# EAGLE schematic zxld383-boost-driver-mk-4.0 (EAGLE 7.5.0)
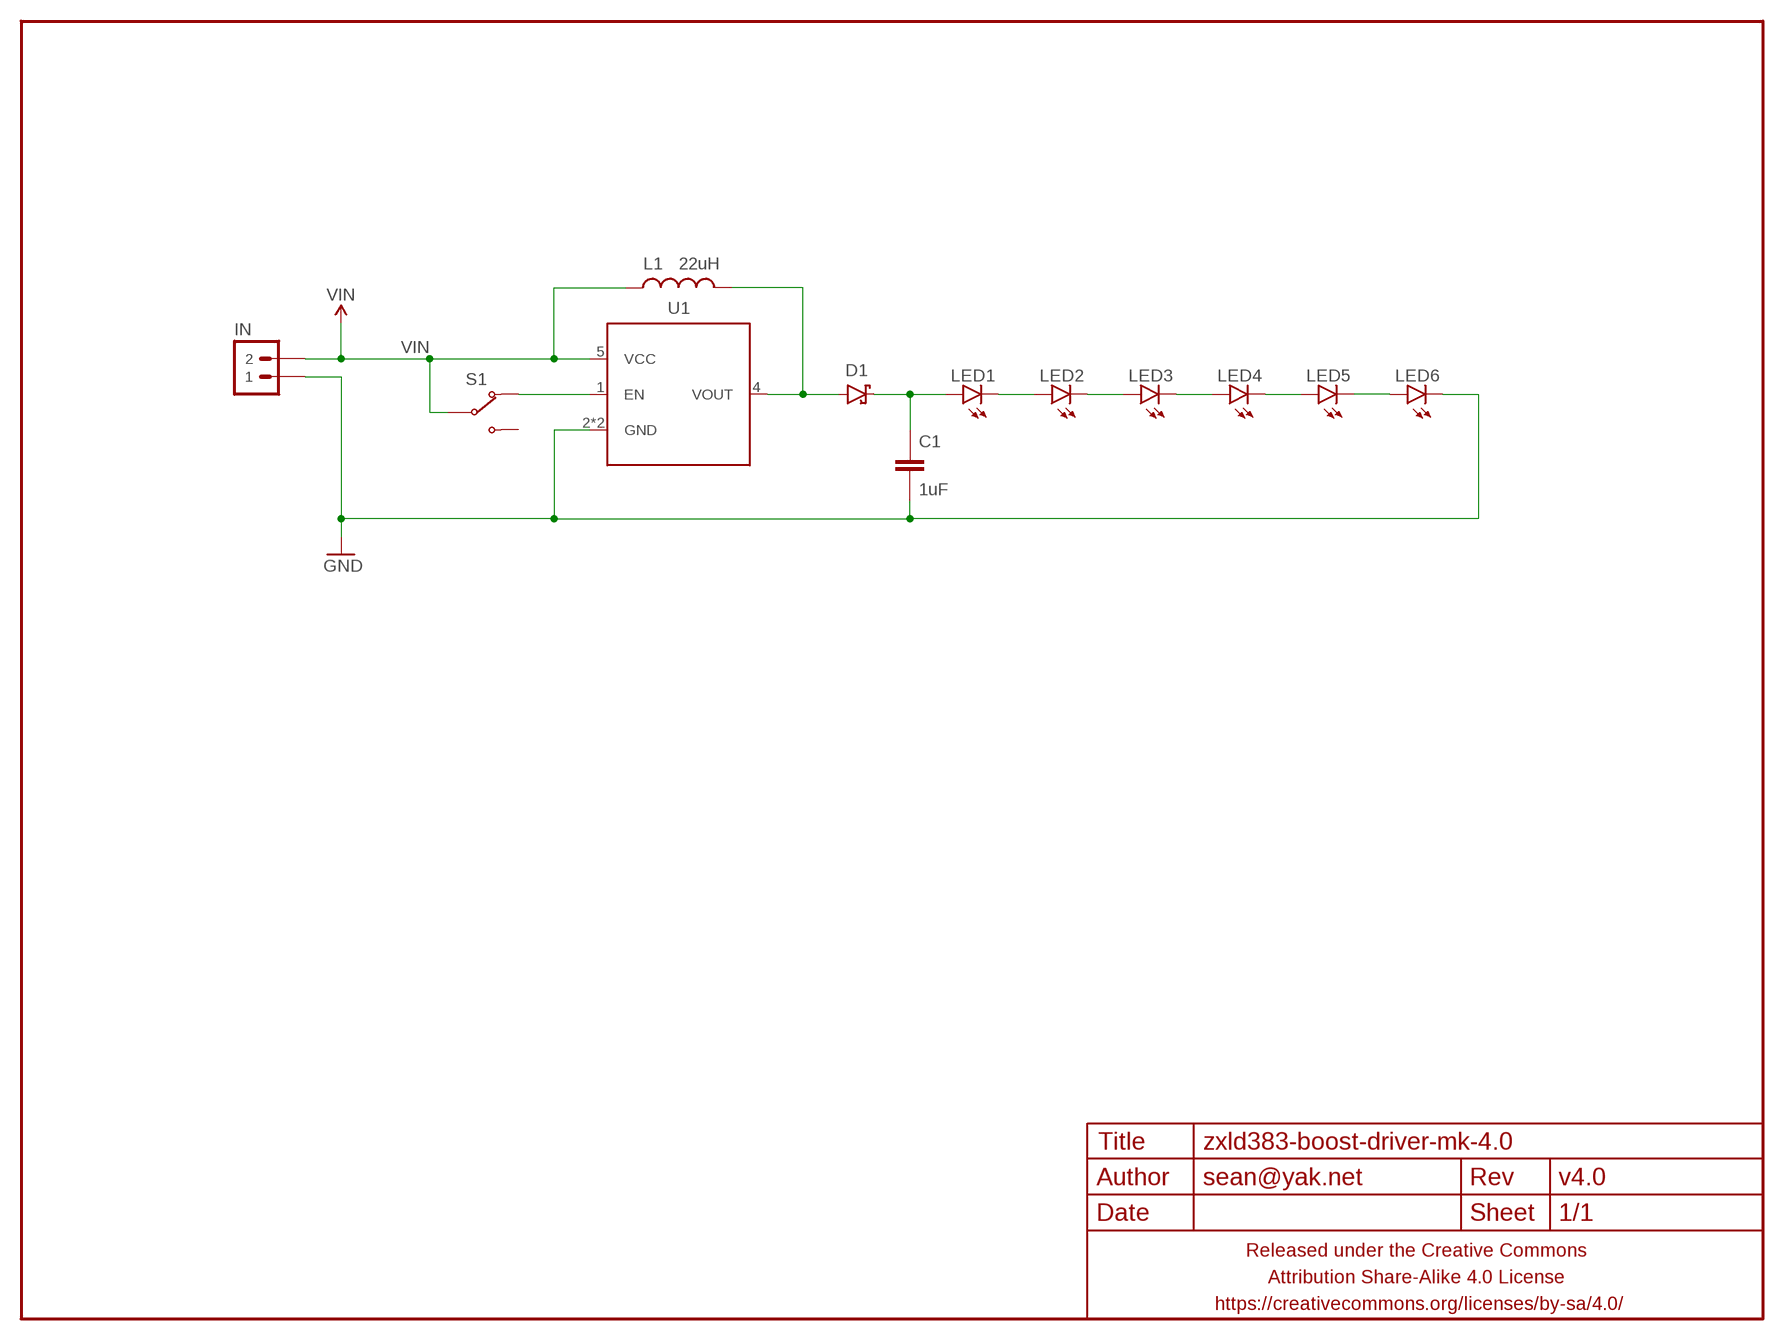
[diagram p0: schematic, sheet 1]

## Parts
C1  1uF  CAPACITOR-CERAMICC0603-TIGHTER  [C0603-TIGHTER]
D1  DIODE-SCHOTTKYSOD323  [SOD323-SCHOTTKY]
FRAME1  FRAME-LETTERNO_PACKAGE  [DUMMY]
IN  M02PTH-CENTERED-R+  [1X02-CENTER-R+]
L1  22uH  INDUCTOR0603-TIGHTER  [L0603]
LED1  LED5MM_SHORTPADS  [LED5MM_SHORTPADS]
LED2  LED5MM_SHORTPADS  [LED5MM_SHORTPADS]
LED3  LED5MM_SHORTPADS  [LED5MM_SHORTPADS]
LED4  LED5MM_SHORTPADS  [LED5MM_SHORTPADS]
LED5  LED5MM_SHORTPADS  [LED5MM_SHORTPADS]
LED6  LED5MM_SHORTPADS  [LED5MM_SHORTPADS]
S1  SWITCH-SPDTSMD-RA  [SWITCH-SPDT-SMD-RA]
U1  ZXLD383  [TSOT-23-5]

## Nets
GND: C1.2 IN.1 LED6.K(C) U1.2(GND) U1.3(GND)
N$1: S1.3(NC) U1.1(EN)
N$2: LED1.K(C) LED2.A
N$3: D1.A L1.2 U1.4(VOUT)
N$4: C1.1 D1.C LED1.A
N$5: LED2.K(C) LED3.A
N$6: LED3.K(C) LED4.A
N$7: LED4.K(C) LED5.A
N$8: LED5.K(C) LED6.A
VIN: IN.2 L1.1 S1.2(COM) U1.5(VCC)
Unconnected: S1.1(NO)

## Library data of the parts
C1 = a_parts:CAPACITOR-CERAMIC: CAPACITOR, European symbol
D1 = a_parts:DIODE-SCHOTTKY: Schottky diodes in SFE's production catalog BAT20J 1A 23V 0.62Vf RB751 120mA 40V 0.37Vf PMEG4005EJ 0.5A 40V 0.42Vf MBRA140 1A 40V 0.5Vf B340A 3A 40V SMA
FRAME1 = a_parts:FRAME-LETTER: Schematic Frame Standard 8.5x11 US Letter frame; DESIGNER: sean@yak.net; VERSION: v4.0
IN = a_parts:M02: Standard 2-pin 0.1" header. Use with - straight break away headers ( PRT-00116) - right angle break away headers (PRT-00553) - swiss pins (PRT-00743) - machine pins (PRT-00117) - female headers (PRT-00115) Molex polarized connector foot print use with: PRT-08233 with associated crimp pins and housings. 2.54_SCREWTERM for use with PRT-10571. 3.5mm Screw Terminal footprints for PRT-08084 5mm Screw Terminal footprints for use with PRT-08433
L1 = a_parts:INDUCTOR: Inductors Basic Inductor/Choke - 0603 and 1206. Footprints are not proven and vary greatly between part numbers. SRN6045- 33uH, 20% 1.4A SDR0403-560KL - 56uH, 10%, 500mA RMS/740mA peak
LED1-LED6 = a_parts:LED: LEDs Standard schematic elements and footprints for 5mm, 3mm, 1206, and 0603 sized LEDs. 5mm - Spark Fun Electronics SKU : COM-00529 (and others)
S1 = a_parts:SWITCH-SPDT
U1 = a_parts:ZXLD383